# EAGLE design Rev A (EAGLE 6.4)
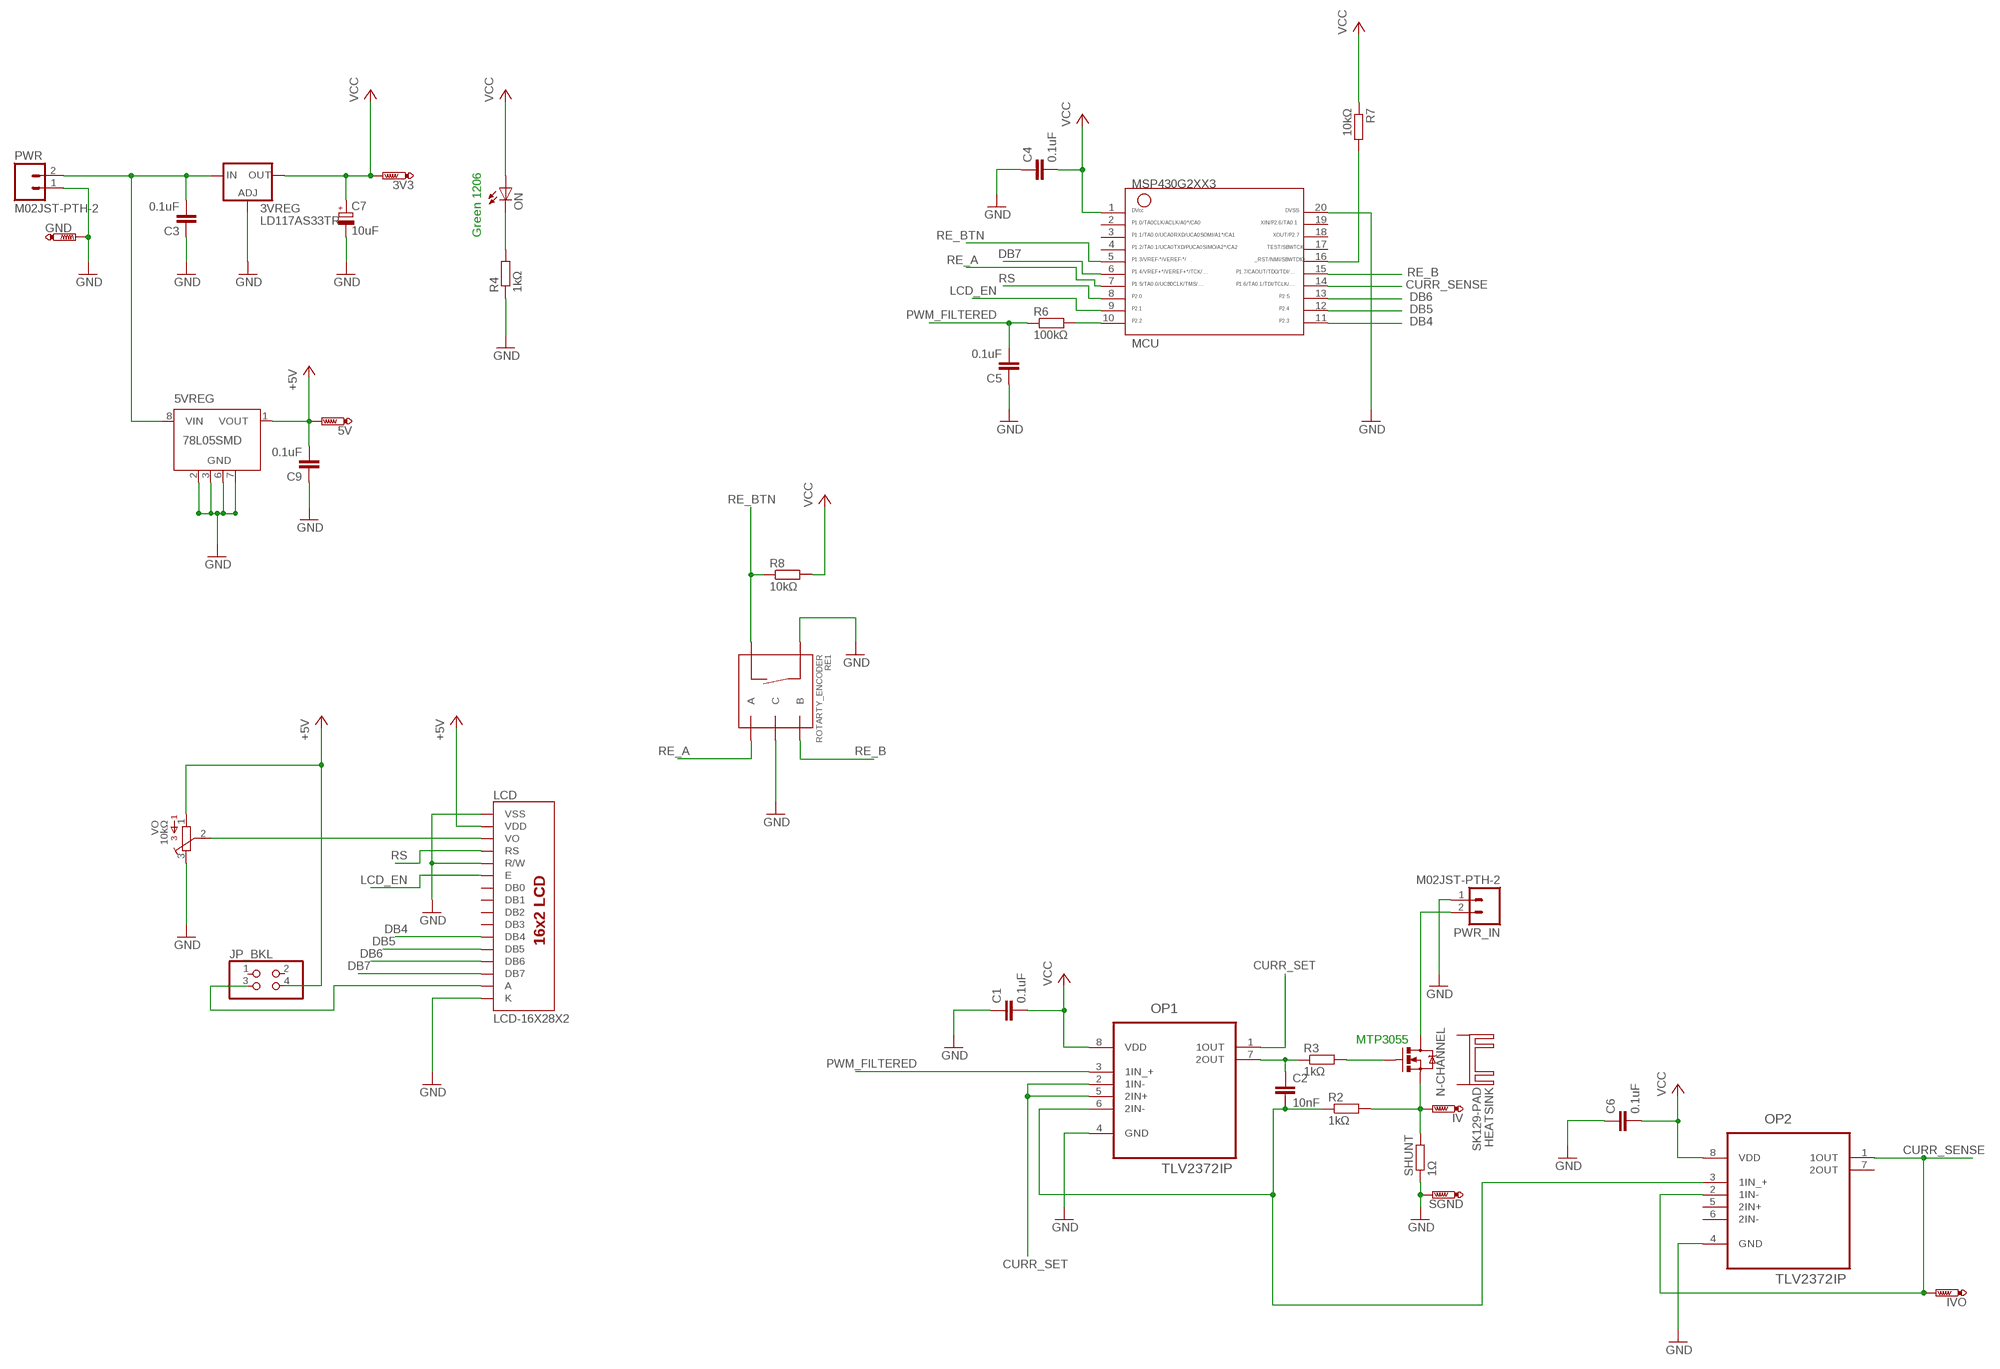
[diagram p0: schematic, sheet 1]

## Parts
3V3  PTR1TP10SQ  [TP10SQ]
3VREG  LD117AS33TR  [SOT223]
5V  PTR1TP10SQ  [TP10SQ]
5VREG  78L05SMD  [SO08]
C1  0.1uF  C-EUC0805  [C0805]
C2  10nF  C-EUC0805  [C0805]
C3  0.1uF  C-EUC0805  [C0805]
C4  0.1uF  C-EUC0805  [C0805]
C5  0.1uF  C-EUC0805  [C0805]
C6  0.1uF  C-EUC0805  [C0805]
C7  10uF  CPOL-EUE2.5-6  [E2,5-6]
C9  0.1uF  C-EUC0805  [C0805]
GND  PTR1TP10SQ  [TP10SQ]
HEATSINK  SK129-PAD  [SK129]
IV  PTR1TP10SQ  [TP10SQ]
IVO  PTR1TP10SQ  [TP10SQ]
JP_BKL  PINHD-2X2  [2X02]
LCD  LCD-16X28X2  [LCD-8X2]
MCU  G2XX3---N20  [N20]
N-CHANNEL  MOSFET-NCHANNELFQP30N06L  [TO220V]
ON  LEDCHIPLED_1206  [CHIPLED_1206]
OP1  TLV2372IP  [DIP254P762X508-8]
OP2  TLV2372IP  [DIP254P762X508-8]
PWR  M02JST-PTH-2  [JST-2-PTH]
PWR_IN  M02JST-PTH-2  [JST-2-PTH]
R2  1kΩ  R-EU_R0805  [R0805]
R3  1kΩ  R-EU_R0805  [R0805]
R4  1kΩ  R-EU_R0805  [R0805]
R6  100kΩ  R-EU_R0805  [R0805]
R7  10kΩ  R-EU_R0805  [R0805]
R8  10kΩ  R-EU_R0805  [R0805]
RE1  ROTARTY_ENCODER  [ROTARY_ENC_PLAIN]
SGND  PTR1TP10SQ  [TP10SQ]
SHUNT  1Ω  R-EU_VTA52  [VTA52]
VO  10kΩ  3386-G  [3386G]

## Nets
+5V: 5V.TP 5VREG.1(VOUT) C9.2 JP_BKL.4 LCD.2(VDD) VO.1
CURR_SENSE: IVO.TP MCU.14 OP2.1(1OUT) OP2.2(1IN-)
CURR_SET: OP1.1(1OUT) OP1.2(1IN-) OP1.5(2IN+)
DB4: LCD.11(DB4) MCU.11
DB5: LCD.12(DB5) MCU.12
DB6: LCD.13(DB6) MCU.13
DB7: LCD.14(DB7) MCU.6
GND: 3VREG.1(ADJ) 5VREG.2(GND) 5VREG.3(GND) 5VREG.6(GND) 5VREG.7(GND) C1.1 C3.1 C4.1 C5.1 C6.1 C7.- C9.1 GND.TP LCD.1(VSS) LCD.5(R/W) LCD.16(K) MCU.20 OP1.4(GND) OP2.4(GND) PWR.1 PWR_IN.1 R4.1 RE1.C RE1.SW+ SGND.TP SHUNT.1 VO.3
LCD_EN: LCD.6(E) MCU.9
N$1: C2.2 OP1.6(2IN-) OP2.3(1IN_+) R2.1
N$3: N-CHANNEL.1(G) R3.2
N$4: C2.1 OP1.7(2OUT) R3.1
N$6: 3VREG.3(IN) 5VREG.8(VIN) C3.2 PWR.2
N$7: ON.C R4.2
N$8: MCU.10 R6.2
N$9: MCU.16 R7.2
N$10: LCD.3(VO) VO.2
N$11: JP_BKL.3 LCD.15(A)
N$13: IV.TP N-CHANNEL.3(S) R2.2 SHUNT.2
PWM_FILTERED: C5.2 OP1.3(1IN_+) R6.1
RE_A: MCU.7 RE1.A
RE_B: MCU.15 RE1.B
RE_BTN: MCU.5 R8.1 RE1.SW-
RS: LCD.4(RS) MCU.8
TVIN: N-CHANNEL.2(D) PWR_IN.2
VCC: 3V3.TP 3VREG.4(OUT) C1.2 C4.2 C6.2 C7.+ MCU.1 ON.A OP1.8(VDD) OP2.8(VDD) R7.1 R8.2
Unconnected: 5VREG.4(NC) 5VREG.5(NC) HEATSINK.A2,5(K) HEATSINK.B2,5(K) JP_BKL.1 JP_BKL.2 LCD.7(DB0) LCD.8(DB1) LCD.9(DB2) LCD.10(DB3) MCU.2 MCU.3 MCU.4 MCU.17 MCU.18 MCU.19 OP2.5(2IN+) OP2.6(2IN-) OP2.7(2OUT)

## Notes on the sheet
- Green 1206
- MTP3055

## Library data of the parts
3V3 5V GND IV IVO SGND = testpad:PTR1: TEST PIN
3VREG = v-reg:LD117A?*: Low drop fixed and adjustable positive voltage regulators 1 A Source: http://www.st.com/stonline/products/literature/ds/7194/ld1117axx.pdf
5VREG = linear:78L*SMD: Positive VOLTAGE REGULATOR
C1-C6 C9 = rcl:C-EU: CAPACITOR, European symbol
C7 = rcl:CPOL-EU: POLARIZED CAPACITOR, European symbol
HEATSINK = heatsink:SK129-PAD: HEATSINK manufacturer Fischer/distributor Buerklin
JP_BKL = pinhead:PINHD-2X2: PIN HEADER
LCD = SparkFun-Displays:LCD-16X2: Standard text-only 16x2 parallel input LCD
MCU = TI_MSP430_v16:G2XX3---N20: MSP430G2XX1 PDIP (N) 20 Pin Package
N-CHANNEL = SparkFun-DiscreteSemi:MOSFET-NCHANNEL: Common NMOSFET Parts MFG P/N Store ID Prod ID FDD8780 TRANS-09984 SI7820DN TRANS-11055 FDS6630A IC-08089 2N7002PW TRANS-11151 FQP30N06L COM-10213 TRANS-10060 BSS123LT1G TRANS-08345 BSS138 TRANS-00830 BS170 2N7000; PROD_ID: TRANS-10060
ON = led:LED: LED OSRAM: - CHIPLED LG R971, LG N971, LY N971, LG Q971, LY Q971, LO R971, LY R971 LH N974, LH R974 LS Q976, LO Q976, LY Q976 LO Q996 - Hyper CHIPLED LW Q18S LB Q993, LB Q99A, LB R99A - SideLED LS A670, LO A670, LY A670, LG A670, LP A670 LB A673, LV A673, LT A673, LW A673 LH A674 LY A675 LS A676, LA A676, LO A676, LY A676, LW A676 LS A679, LY A679, LG A679 - Hyper Micro SIDELED® LS Y876, LA Y876, LO Y876, LY Y876 LT Y87S - SmartLED LW L88C, LW L88S LB L89C, LB L89S, LG L890 LS L89K, LO L89K, LY L89K LS L896, LA L896, LO L896, LY L896 - TOPLED LS T670, LO T670, LY T670, LG T670, LP T670 LSG T670, LSP T670, LSY T670, LOP T670, LYG T670 LG T671, LOG T671, LSG T671 LB T673, LV T673, LT T673, LW T673 LH T674 LS T676, LA T676, LO T676, LY T676, LB T676, LH T676, LSB T676, LW T676 LB T67C, LV T67C, LT T67C, LS T67K, LO T67K, LY T67K, LW E67C LS E67B, LA E67B, LO E67B, LY E67B, LB E67C, LV E67C, LT E67C LW T67C LS T679, LY T679, LG T679 LS T770, LO T770, LY T770, LG T770, LP T770 LB T773, LV T773, LT T773, LW T773 LH T774 LS E675, LA E675, LY E675, LS T675 LS T776, LA T776, LO T776, LY T776, LB T776 LHGB T686 LT T68C, LB T68C - Hyper Mini TOPLED® LB M676 - Mini TOPLED Santana® LG M470 LS M47K, LO M47K, LY M47K Source: http://www.osram.convergy.de LUXEON: - LUMILED® LXK2-PW12-R00, LXK2-PW12-S00, LXK2-PW14-U00, LXK2-PW14-V00 LXK2-PM12-R00, LXK2-PM12-S00, LXK2-PM14-U00 LXK2-PE12-Q00, LXK2-PE12-R00, LXK2-PE12-S00, LXK2-PE14-T00, LXK2-PE14-U00 LXK2-PB12-K00, LXK2-PB12-L00, LXK2-PB12-M00, LXK2-PB14-N00, LXK2-PB14-P00, LXK2-PB14-Q00 LXK2-PR12-L00, LXK2-PR12-M00, LXK2-PR14-Q00, LXK2-PR14-R00 LXK2-PD12-Q00, LXK2-PD12-R00, LXK2-PD12-S00 LXK2-PH12-R00, LXK2-PH12-S00 LXK2-PL12-P00, LXK2-PL12-Q00, LXK2-PL12-R00 Source: www.luxeon.com KINGBRIGHT: KA-3528ASYC Source: www.kingbright.com
OP1 OP2 = Texas Instruments_By_element14_Batch_1:TLV2372IP: OPERATIONAL AMPLIFIER; MPN: TLV2372IP; OC_FARNELL: 8455031; OC_NEWARK: 76C7976; PACKAGE: PDIP; SUPPLIER: Texas Instruments
PWR PWR_IN = SparkFun-Connectors:M02: Standard 2-pin 0.1" header. Use with - straight break away headers ( PRT-00116) - right angle break away headers (PRT-00553) - swiss pins (PRT-00743) - machine pins (PRT-00117) - female headers (PRT-00115) Molex polarized connector foot print use with: PRT-08233 with associated crimp pins and housings. 2.54_SCREWTERM for use with PRT-10571. 3.5mm Screw Terminal footprints for PRT-08084 5mm Screw Terminal footprints for use with PRT-08433
R2-R4 R6 R8 SHUNT = rcl:R-EU_: RESISTOR, European symbol
R7 = resistor:R-EU_: RESISTOR, European symbol
RE1 = SparkFun-Electromechanical:ROTARTY_ENCODER: Simple no LED rotary encoder Example: COM-09117
VO = bourns:3386-: 3386 Series 3/8" Square Trimmer

## Board
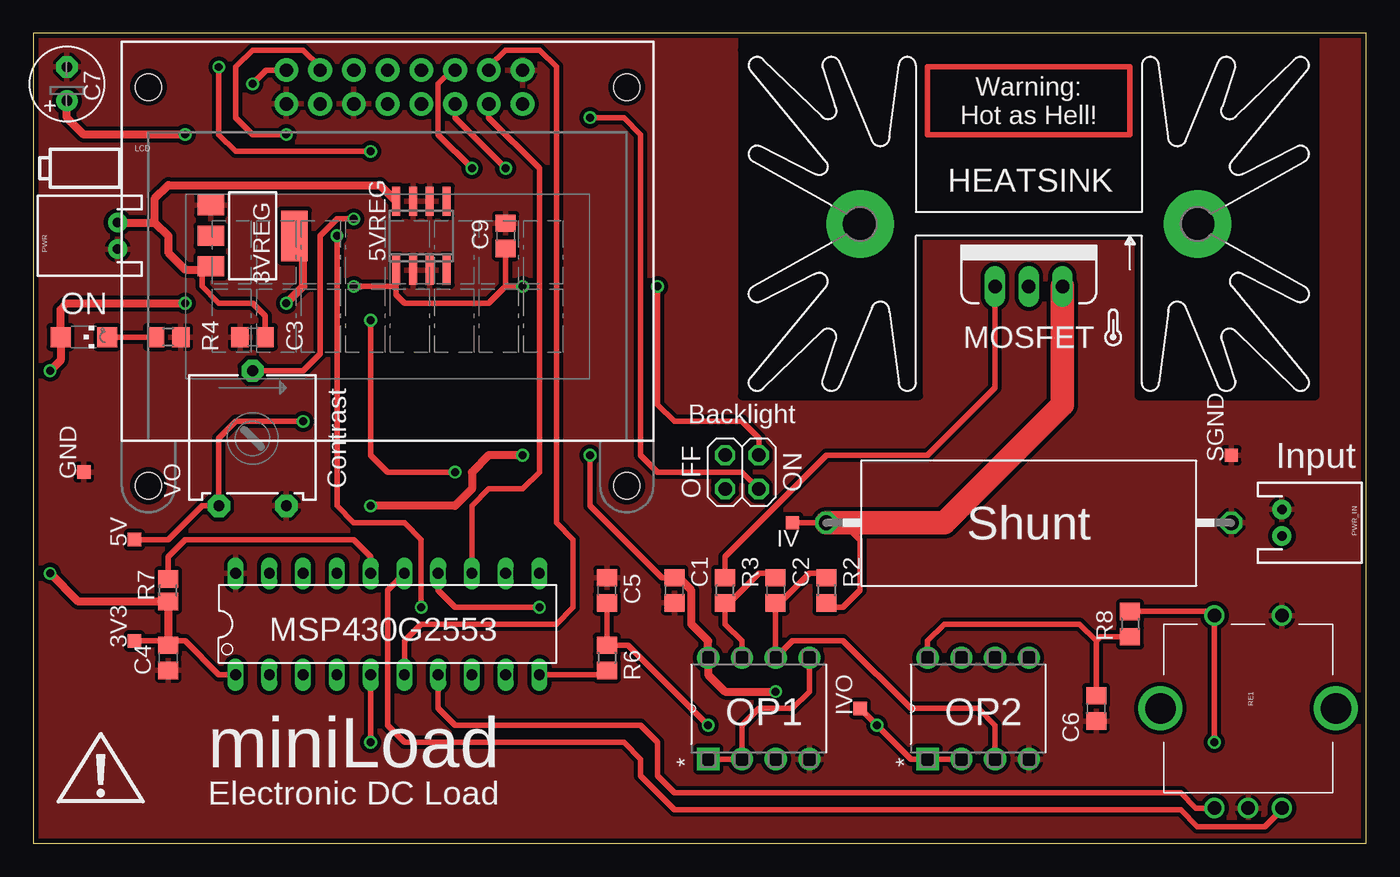
[diagram p1: board, top side]
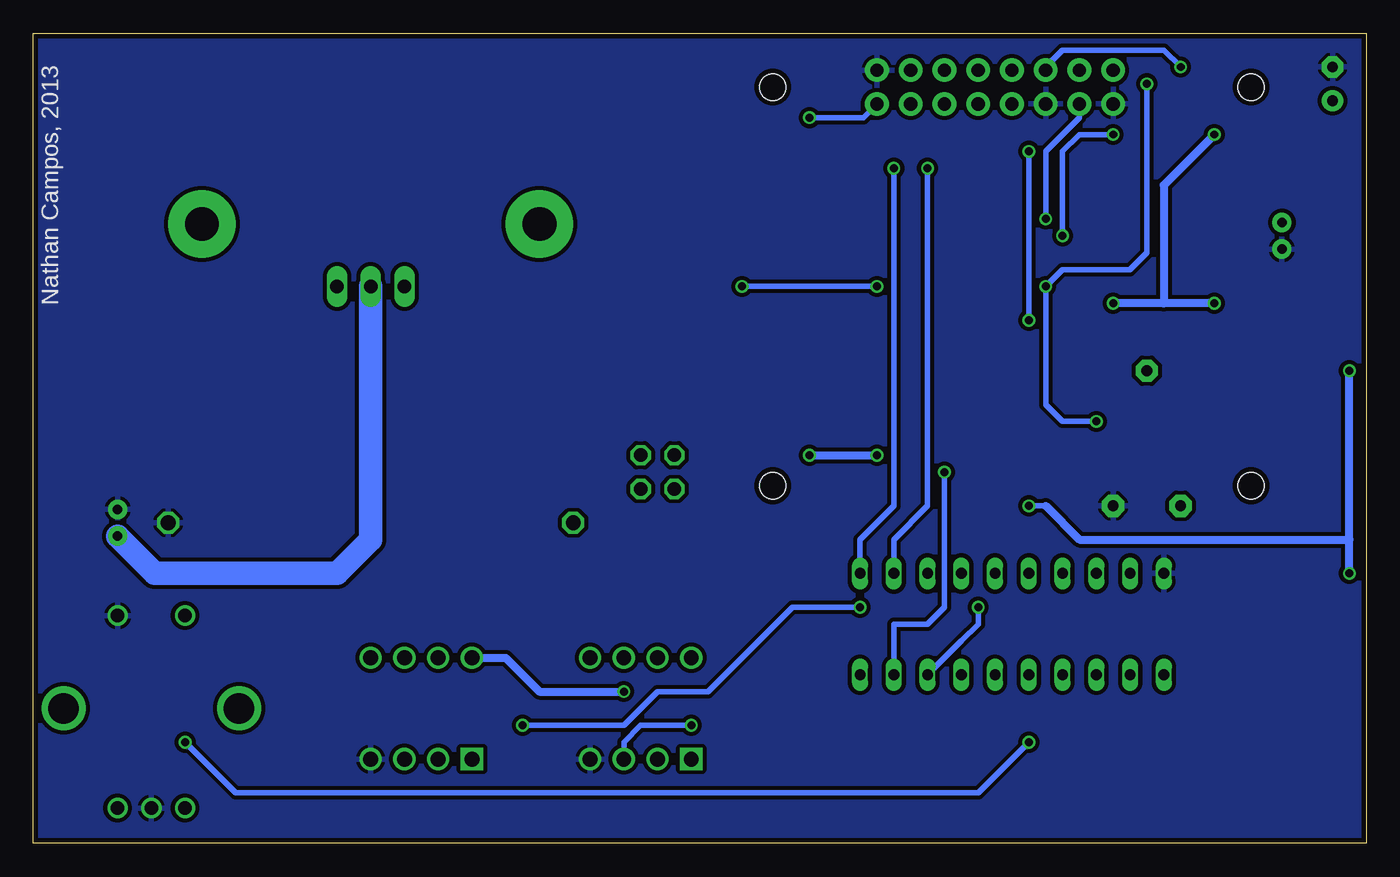
[diagram p2: board, bottom side, seen from below]

Size 100.33 x 60.96 mm. Coordinates in mm from the lower left corner, seen from the top.
Outline: 0,0 100.33,0 100.33,60.96 0,60.96 0,0
Copper layers (1*16): Top 0.0356mm / dielectric 1.5011mm / Bottom 0.0356mm
Design rules "LaenPCBOrder": minimum track width 6mil, minimum drill 13mil, track to track 6mil, track to pad 6mil, pad to pad 6mil, via to via 6mil, smd to smd 6mil, copper to edge 15mil, drill to drill 6mil, minimum pad ring 7mil, minimum via ring 7mil, stop-mask expansion 4mil, vias tented up to drill 0mil, thermal gap 10mil
tRestrict: area 53.3,59.7 to 96.5,61

### Footprints (pad centres in the part's own frame; a part is rotated, then mirrored left to right if it is on the bottom)
TP10SQ = smd 1 x 1: TP 0,0
SOT223 = smd 1.5 x 2: 1 -2.3,-3.15; 2 0,-3.15; 3 2.3,-3.15 | smd 3.8 x 2: 4 0,3.15
SO08 = smd 0.6 x 2.2: 1 -1.905,-2.6; 2 -0.635,-2.6; 3 0.635,-2.6; 4 1.905,-2.6; 5 1.905,2.6; 6 0.635,2.6; 7 -0.635,2.6; 8 -1.905,2.6
C0805 = smd 1.3 x 1.5: 1 -0.95,0; 2 0.95,0
E2,5-6 = drill 0.813 pad 1.6: + -1.27,0 | drill 0.813 pad 1.6 octagon: - 1.27,0
SK129 = drill 2.54 pad 5.08: A2,5 -12.7,-0.889; B2,5 12.7,-0.889
2X02 = drill 1.016 octagon: 1 -1.27,-1.27; 2 -1.27,1.27; 3 1.27,-1.27; 4 1.27,1.27
LCD-8X2 = drill 1 pad 1.778: 1 -7.62,13.73; 2 -7.62,16.27; 3 -5.08,13.73; 4 -5.08,16.27; 5 -2.54,13.73; 6 -2.54,16.27; 7 0,13.73; 8 0,16.27; 9 2.54,13.73; 10 2.54,16.27; 11 5.08,13.73; 12 5.08,16.27; 13 7.62,13.73; 14 7.62,16.27; 15 10.16,13.73; 16 10.16,16.27 | hole 2: 18,15; -18,15; -18,-15; 18,-15
N20 = drill 0.813 long: 1 -11.435,-3.81; 2 -8.895,-3.81; 3 -6.355,-3.81; 4 -3.815,-3.81; 5 -1.275,-3.81; 6 1.265,-3.81; 7 3.805,-3.81; 8 6.345,-3.81; 9 8.885,-3.81; 10 11.425,-3.81; 11 11.425,3.81; 12 8.885,3.81; 13 6.345,3.81; 14 3.805,3.81; 15 1.265,3.81; 16 -1.275,3.81; 17 -3.815,3.81; 18 -6.355,3.81; 19 -8.895,3.81; 20 -11.435,3.81
TO220V = drill 1.016 long: 1 -2.54,0; 2 0,0; 3 2.54,0
CHIPLED_1206 = smd 1.5 x 1.5: A 0,-1.75; C 0,1.75
DIP254P762X508-8 = drill 1.118 square: 1 -7.62,7.62 | drill 1.118: 2 -7.62,5.08; 3 -7.62,2.54; 4 -7.62,0; 5 0,0; 6 0,2.54; 7 0,5.08; 8 0,7.62
JST-2-PTH = drill 0.7 pad 1.448: 1 -1,0; 2 1,0
R0805 = smd 1.3 x 1.5: 1 -0.95,0; 2 0.95,0
R0805' = smd 1.3 x 1.5: 1 -0.85,0; 2 0.85,0
ROTARY_ENC_PLAIN = drill 1.016: A 7.493,-2.54; B 7.493,2.54; C 7.493,0; SW+ -6.985,2.54; SW- -6.985,-2.54 | drill 2.286: P$3 0,6.604; P$4 0,-6.604
VTA52 = drill 1.1 octagon: 1 -15.24,0; 2 15.24,0
3386G = drill 0.813 pad 1.676 octagon: 1 -2.54,-5.08; 2 0,5.08; 3 2.54,-5.08

### Placement (x,y rotation side)
3V3  7.62,15.24 90 top
3VREG  16.51,45.72 270 top
5V  7.62,22.86 90 top
5VREG  29.21,45.72 0 top
C1  48.26,19.05 90 top
C2  55.88,19.05 270 top
C3  16.51,38.1 0 top
C4  10.16,13.97 90 top
C5  43.18,19.05 270 top
C6  80.01,10.16 90 top
C7  2.54,57.15 90 top
C9  35.56,45.72 270 top
GND  3.81,27.94 90 top
HEATSINK  74.93,45.72 180 top
IV  57.15,24.13 180 top
IVO  62.23,10.16 90 top
JP_BKL  53.34,27.94 0 top
LCD  26.67,41.91 0 top
MCU  26.67,16.51 0 top
N-CHANNEL  74.93,41.91 0 top
ON  3.81,38.1 270 top
OP1  58.42,13.97 90 top
OP2  74.93,13.97 90 top
PWR  6.35,45.72 90 top
PWR_IN  93.98,24.13 270 top
R2  59.69,19.05 270 top
R3  52.07,19.05 90 top
R4  10.16,38.1 180 top
R6  43.18,13.97 270 top
R7  10kΩ  [R0805']  10.16,19.05 90 top
R8  82.55,16.51 270 top
RE1  91.44,10.16 270 top
SGND  90.17,29.21 90 top
SHUNT  74.93,24.13 180 top
U$1  [ICON_TEMP]  81.28,38.1 0 top
U$2  [ICON_EXL-S]  5.08,5.08 0 top
U$3  [ICON_BATTERY-S]  3.81,50.8 180 top
VO  16.51,30.48 0 top

### Tracks (layer width: path | path; a pad name or v marks a point on that pad's centre or on a via)
+5V  (via drill 0.6)
  Top 0.406: 27.3,41.91 27.3,41.27 27.94,40.64 34.29,40.64 35.56,41.91 | 27.3,41.91 5VREG.1 | 35.56,41.91 C9.2 | LCD.2 17.54,58.18 v16.51,57.15 | v24.13,41.91 27.3,41.91 | JP_BKL.4 54.61,30.48 53.34,31.75 48.26,31.75 46.99,33.02 v46.99,41.91 | v36.83,41.91 35.56,41.91 | v20.32,31.75 15.24,31.75 13.97,30.48 VO.1 12.7,25.4 10.16,22.86 5V.TP
  Bottom 0.406: v16.51,57.15 16.51,44.45 17.78,43.18 22.86,43.18 v24.13,41.91 24.13,33.02 22.86,31.75 v20.32,31.75 | v46.99,41.91 v36.83,41.91
CURR_SENSE  (via drill 0.6)
  Top 0.406: OP2.2 OP2.1 66.04,6.35 v63.5,8.89 IVO.TP | MCU.14 30.48,19.05 31.75,17.78 v38.1,17.78
  Bottom 0.406: v63.5,8.89 55.88,8.89 53.34,11.43 49.53,11.43 43.18,17.78 v38.1,17.78
CURR_SET
  Top 0.406: OP1.1 OP1.2 53.34,8.89 54.61,10.16 57.15,10.16 58.42,11.43 OP1.5
DB4  (via drill 0.6)
  Top 0.406: LCD.11 31.75,54.61 v35.56,50.8
  Bottom 0.406: v35.56,50.8 35.56,25.4 38.1,22.86 MCU.11
DB5  (via drill 0.6)
  Top 0.406: LCD.12 31.51,58.18 30.48,57.15 30.48,53.34 v33.02,50.8
  Bottom 0.406: v33.02,50.8 33.02,25.4 35.56,22.86 MCU.12
DB6
  Top 0.406: LCD.13 34.29,54.61 38.1,50.8 38.1,27.94 36.83,26.67 34.29,26.67 33.02,25.4 MCU.13
DB7
  Top 0.406: LCD.14 34.29,58.42 35.56,59.69 38.1,59.69 39.37,58.42 39.37,24.13 40.64,22.86 40.64,17.78 39.37,16.51 29.21,16.51 27.94,15.24 MCU.6
GND
  pour Top (isolate 0.305): 0,60.96 100.33,60.96 100.33,0 0,0
  pour Bottom (isolate 0.305): 0,60.96 100.33,60.96 100.33,0 0,0
LCD_EN  (via drill 0.6)
  Top 0.406: v13.97,58.42 13.97,53.34 15.24,52.07 v25.4,52.07 | v25.4,39.37 25.4,29.21 26.67,27.94 v31.75,27.94
  Bottom 0.406: LCD.6 24.13,58.42 22.86,59.69 15.24,59.69 v13.97,58.42 | v25.4,52.07 v25.4,39.37 | v31.75,27.94 31.75,17.78 33.02,16.51 35.56,16.51 MCU.9
N$1
  Top 0.406: R2.1 59.37,20.32 58.42,20.32 56.2,18.1 C2.2 OP1.6 57.15,15.24 60.96,15.24 66.04,10.16 71.12,10.16 72.39,8.89 OP2.3
N$3
  Top 0.406: N-CHANNEL.1 72.39,34.29 67.31,29.21 59.69,29.21 52.07,21.59 R3.2
N$4
  Top 0.406: OP1.7 53.34,15.24 52.07,16.51 R3.1 52.39,18.1 54.61,20.32 55.56,20.32 C2.1
N$5
  Top 0.406: 67.31,58.42 67.31,53.34 82.55,53.34 82.55,58.42 67.31,58.42
N$6
  Top 0.406: C3.2 17.46,39.69 16.51,40.64 13.97,40.64 12.7,41.91 12.7,42.76 3VREG.3
  Top 0.61: PWR.2 9.16,46.72 | 9.16,46.72 10.16,45.72 10.16,44.45 11.43,43.18 13.12,43.18 3VREG.3 | 9.16,46.72 9.16,48.53 10.16,49.53 26.09,49.53 5VREG.8
N$7
  Top 0.406: R4.2 ON.C
N$8
  Top 0.406: MCU.10 42.86,12.7 R6.2
N$9
  Top 0.406: R7.2 10.16,21.59 11.43,22.86 24.13,22.86 25.4,21.59 MCU.16
N$10  (via drill 0.6)
  Top 0.406: VO.2 20.32,35.56 21.59,36.83 21.59,45.72 22.86,46.99 v24.13,46.99
  Bottom 0.406: v24.13,46.99 24.13,52.07 21.59,54.61 LCD.3
N$11  (via drill 0.6)
  Top 0.406: JP_BKL.3 53.34,27.94 46.99,27.94 45.72,29.21 45.72,53.34 44.45,54.61 v41.91,54.61
  Bottom 0.406: v41.91,54.61 37.86,54.61 LCD.15
N$13
  Top 0.406: R2.2 60.01,17.78 60.96,17.78 62.23,19.05 62.23,22.86 60.96,24.13 SHUNT.2 IV.TP
  Top 1.778: SHUNT.2 68.58,24.13 77.47,33.02 N-CHANNEL.3
PWM_FILTERED  (via drill 0.6)
  Top 0.406: C5.2 R6.1 44.77,14.92 v50.8,8.89
  Bottom 0.406: v50.8,8.89 54.61,8.89 55.88,7.62 OP1.3
RE_A
  Top 0.406: RE1.A 87.5,2.67 86.36,3.81 48.26,3.81 46.99,5.08 46.99,7.62 45.72,8.89 31.75,8.89 30.48,10.16 MCU.7
RE_B
  Top 0.406: RE1.B 93.98,2.54 92.71,1.27 87.63,1.27 86.36,2.54 48.26,2.54 45.72,5.08 45.72,6.35 44.45,7.62 27.94,7.62 26.67,8.89 26.67,19.05 MCU.15
RE_BTN  (via drill 0.6)
  Top 0.406: v88.9,7.62 RE1.SW- 88.58,17.46 R8.1 | v25.4,7.62 MCU.5
  Bottom 0.406: v88.9,7.62 85.09,3.81 29.21,3.81 v25.4,7.62
RS  (via drill 0.6)
  Top 0.406: LCD.4 21.59,58.42 20.32,59.69 16.51,59.69 15.24,58.42 15.24,54.61 16.51,53.34 v19.05,53.34 | v22.86,45.72 22.86,25.4 24.13,24.13 27.94,24.13 29.21,22.86 v29.21,17.78
  Bottom 0.406: v19.05,53.34 21.59,53.34 22.86,52.07 v22.86,45.72 | v29.21,17.78 29.21,16.51 30.48,15.24 30.48,15.23 MCU.8
TVIN
  Bottom 1.778: N-CHANNEL.2 74.93,22.86 77.47,20.32 91.17,20.32 PWR_IN.2
VCC  (via drill 0.6)
  Top 0.406: 48.26,20.32 C1.2 47.31,20 41.91,25.4 v41.91,29.21 | 20.32,45.06 3VREG.4 | C6.2 80.01,15.24 | 80.01,15.24 78.74,16.51 68.58,16.51 67.31,15.24 OP2.8 | R8.2 80.33,15.56 80.01,15.24 | MCU.1 13.97,12.7 11.43,15.24 10.48,15.24 C4.2 9.84,15.24 3V3.TP
  Top 0.61: 48.26,20.32 49.53,19.05 49.53,16.51 50.8,15.24 OP1.8 50.8,12.7 52.07,11.43 v55.88,11.43 | v11.43,40.64 2.54,40.64 2.06,40.16 ON.A 2.06,36.35 v1.27,35.56 | v19.05,40.64 20.32,41.91 20.32,45.06 | C4.2 R7.1 3.39,18.2 v1.27,20.32 | v36.83,29.21 34.29,29.21 33.02,27.94 33.02,26.67 31.75,25.4 v25.4,25.4 | v11.43,53.34 3.81,53.34 2.54,54.61 C7.+
  Bottom 0.406: v25.4,25.4 24.13,25.4
  Bottom 0.61: v11.43,40.64 15.24,40.64 | 15.24,40.64 v19.05,40.64 | v1.27,20.32 1.27,22.86 | 1.27,22.86 v1.27,35.56 | v11.43,53.34 15.24,49.53 15.24,40.64 | OP2.8 64.77,13.97 62.23,11.43 v55.88,11.43 | v41.91,29.21 v36.83,29.21 | 24.13,25.4 21.59,22.86 1.27,22.86

### Text on the board
tPlace: Warning: / Hot as Hell! | ON | MOSFET | Backlight | Contrast | Input | OFF | ON | Shunt | MSP430G2553 | miniLoad | Electronic DC Load
bPlace: Nathan Campos, 2013